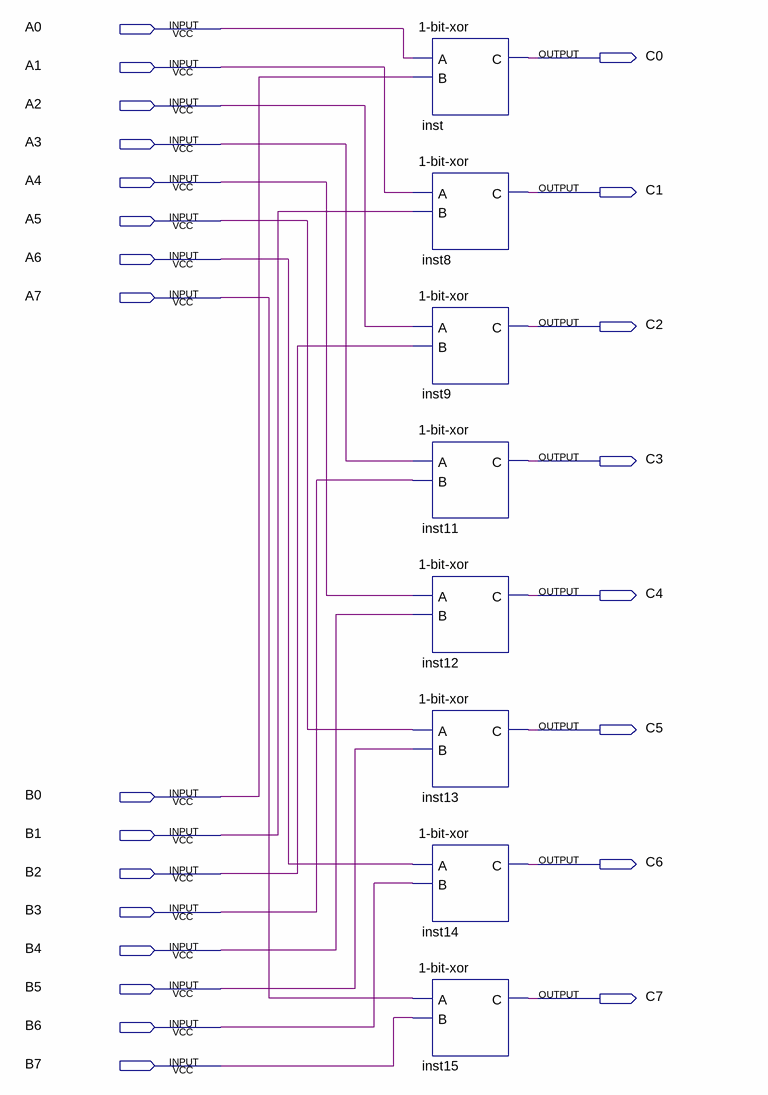
[diagram p0: schematic sheet]
// Quartus schematic 8-bit-xor.bdf as structural Verilog: 8 symbols, 24 pins
module \8-bit-xor  (
  input  A0,
  input  A1,
  input  A2,
  input  A3,
  input  A4,
  input  A5,
  input  A6,
  input  A7,
  input  B0,
  input  B1,
  input  B2,
  input  B3,
  input  B4,
  input  B5,
  input  B6,
  input  B7,
  output C0,
  output C1,
  output C2,
  output C3,
  output C4,
  output C5,
  output C6,
  output C7
);

  \1-bit-xor  inst (.A(A0), .B(B0), .C(C0));
  \1-bit-xor  inst8 (.A(A1), .B(B1), .C(C1));
  \1-bit-xor  inst9 (.A(A2), .B(B2), .C(C2));
  \1-bit-xor  inst11 (.A(A3), .B(B3), .C(C3));
  \1-bit-xor  inst12 (.A(A4), .B(B4), .C(C4));
  \1-bit-xor  inst13 (.A(A5), .B(B5), .C(C5));
  \1-bit-xor  inst14 (.A(A6), .B(B6), .C(C6));
  \1-bit-xor  inst15 (.A(A7), .B(B7), .C(C7));
endmodule
